# Altium schematic sheet AIR_Control1_Relay_080116.SchDoc
size A3
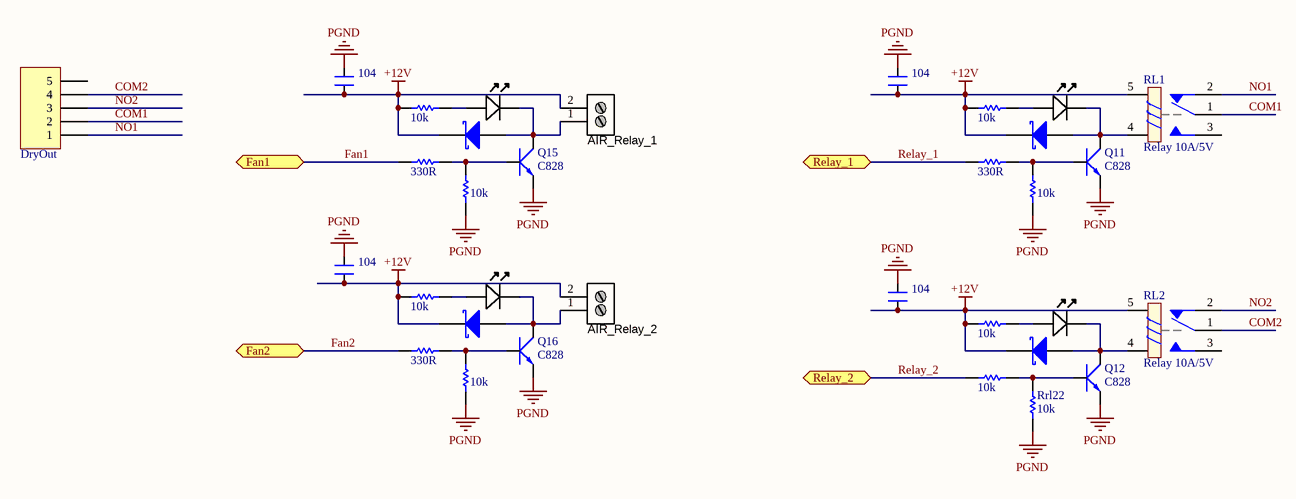
[diagram p0: AIR_Control1_Relay_080116.SchDoc]

## Parts
AIR_Relay_1  Stackable ScrewTerm  [2P_PCB_ScrewTerm_200mil]  (value not drawn)
AIR_Relay_2  Stackable ScrewTerm  [2P_PCB_ScrewTerm_200mil]  (value not drawn)
Crl1  value 104  [CAPC2012N_F]  (hidden comment: CAP NP)
Crl2  value 104  [CAPC2012N_F]  (hidden comment: CAP NP)
Crl5  value 104  [CAPC2012N_F]  (hidden comment: CAP NP)
Crl6  value 104  [CAPC2012N_F]  (hidden comment: CAP NP)
D11  Diode  [DO-214AC]  (value not drawn)
D12  Diode  [DO-214AC]  (value not drawn)
D15  Diode  [DO-214AC]  (value not drawn)
D16  Diode  [DO-214AC]  (value not drawn)
DryOut  Header 5  [HDR1X5]  (value not drawn)
E1  Blue  [LED-0805-A]  (value not drawn)
E2  Blue  [LED-0805-A]  (value not drawn)
E5  Blue  [LED-0805-A]  (value not drawn)
E6  Blue  [LED-0805-A]  (value not drawn)
Q11  C828  [SOT23 TOP]
Q12  C828  [SOT23 TOP]
Q15  C828  [SOT23 TOP]
Q16  C828  [SOT23 TOP]
RL1  Relay 10A/5V  [RL_5PIN]
RL2  Relay 10A/5V  [RL_5PIN]
Rl52  value 10k  [RESC1608N_ZERO]  (hidden comment: Res)
Rrl11  value 330R  [RESC1608N_ZERO]  (hidden comment: Res)
Rrl12  value 10k  [RESC1608N_ZERO]  (hidden comment: Res)
Rrl13  value 10k  [RESC1608N_ZERO]  (hidden comment: Res)
Rrl21  value 10k  [RESC1608N_ZERO]  (hidden comment: Res)
Rrl22  value 10k  [RESC1608N_ZERO]  (hidden comment: Res)
Rrl23  value 10k  [RESC1608N_ZERO]  (hidden comment: Res)
Rrl51  value 330R  [RESC1608N_ZERO]  (hidden comment: Res)
Rrl53  value 10k  [RESC1608N_ZERO]  (hidden comment: Res)
Rrl61  value 330R  [RESC1608N_ZERO]  (hidden comment: Res)
Rrl62  value 10k  [RESC1608N_ZERO]  (hidden comment: Res)
Rrl63  value 10k  [RESC1608N_ZERO]  (hidden comment: Res)

## Ports
Fan1, Fan2, Relay_1, Relay_2

## Nets
+12V: AIR_Relay_1.2 AIR_Relay_2.2 Crl1.1 Crl2.1 Crl5.1 Crl6.1 D11.2(K) D12.2(K) D15.2(K) D16.2(K) RL1.5 RL2.5 Rrl13.2 Rrl23.2 Rrl53.2 Rrl63.2
PGND: Crl1.2 Crl2.2 Crl5.2 Crl6.2 Q11.3(E) Q12.3(E) Q15.3(E) Q16.3(E) Rl52.1 Rrl12.1 Rrl22.1 Rrl62.1
COM1: DryOut.2 RL1.1
COM2: DryOut.4 RL2.1
Fan1: Rrl51.1 ; port Fan1
Fan2: Rrl61.1 ; port Fan2
NO1: DryOut.1 RL1.2
NO2: DryOut.3 RL2.2
Relay_1: Rrl11.1 ; port Relay_1
Relay_2: Rrl21.1 ; port Relay_2
NetAIR_Relay_1_1: AIR_Relay_1.1 D15.1(A) E5.K Q15.2(C)
NetAIR_Relay_2_1: AIR_Relay_2.1 D16.1(A) E6.K Q16.2(C)
NetD11_1: D11.1(A) E1.K Q11.2(C) RL1.4
NetD12_1: D12.1(A) E2.K Q12.2(C) RL2.4
NetE1_A: E1.A Rrl13.1
NetE2_A: E2.A Rrl23.1
NetE5_A: E5.A Rrl53.1
NetE6_A: E6.A Rrl63.1
NetQ11_1: Q11.1(B) Rrl11.2 Rrl12.2
NetQ12_1: Q12.1(B) Rrl21.2 Rrl22.2
NetQ15_1: Q15.1(B) Rl52.2 Rrl51.2
NetQ16_1: Q16.1(B) Rrl61.2 Rrl62.2

Not connected (* = marked no-connect by the designer): DryOut 5; RL1 3; RL2 3

## Library data of the parts
AIR_Relay_1 AIR_Relay_2 = 2P_ScrewTerm_90S_3.81MM: Terminal Block Screw Type THT 2-Position 3.81mm pitch; Manufacturer 1: Tyco Electronics; Manufacturer Part Number 1: 1776113-2; Value: 2 position; Pitch: 0.150" (3.81mm); Positions Per Level: 2; Package / Case: Side Entry; 3.81mm pitch; Category: Connectors Interconnects; Color: Black; Supplier 1: Digi-Key; Supplier Part Number 1: A97976-ND
D11 D12 D15 D16 = Diode: pin to pad: 1>A 2>K
DryOut = Header 5: Header, 5-Pin; LatestRevisionDate: 17-Jul-2002; LatestRevisionNote: Re-released for DXP Platform.; Publisher: Altium Limited
E1 E2 E5 E6 = LED_SMD_Blue_0805_100mcd: LED 0805 SMD Blue 100mcd 470nm; Manufacturer 1: Ligitek; Manufacturer Part Number 1: LG-170DBKZ-CT; Ratings: 100 mcd; 470 nm; Package / Case: 0805; Material: InGaN/GaN; Value: Blue; Color: Blue
Q11 Q12 Q15 Q16 = NPN: Transistor C828 C1815....
RL1 RL2 = Relay 1: Relay SPDT,10A - 12VDC 5 Pin; Value: Relay SPDT, 10A, 12V